# EAGLE design lipo_charger_sense_nicolai (EAGLE 7.1.0)
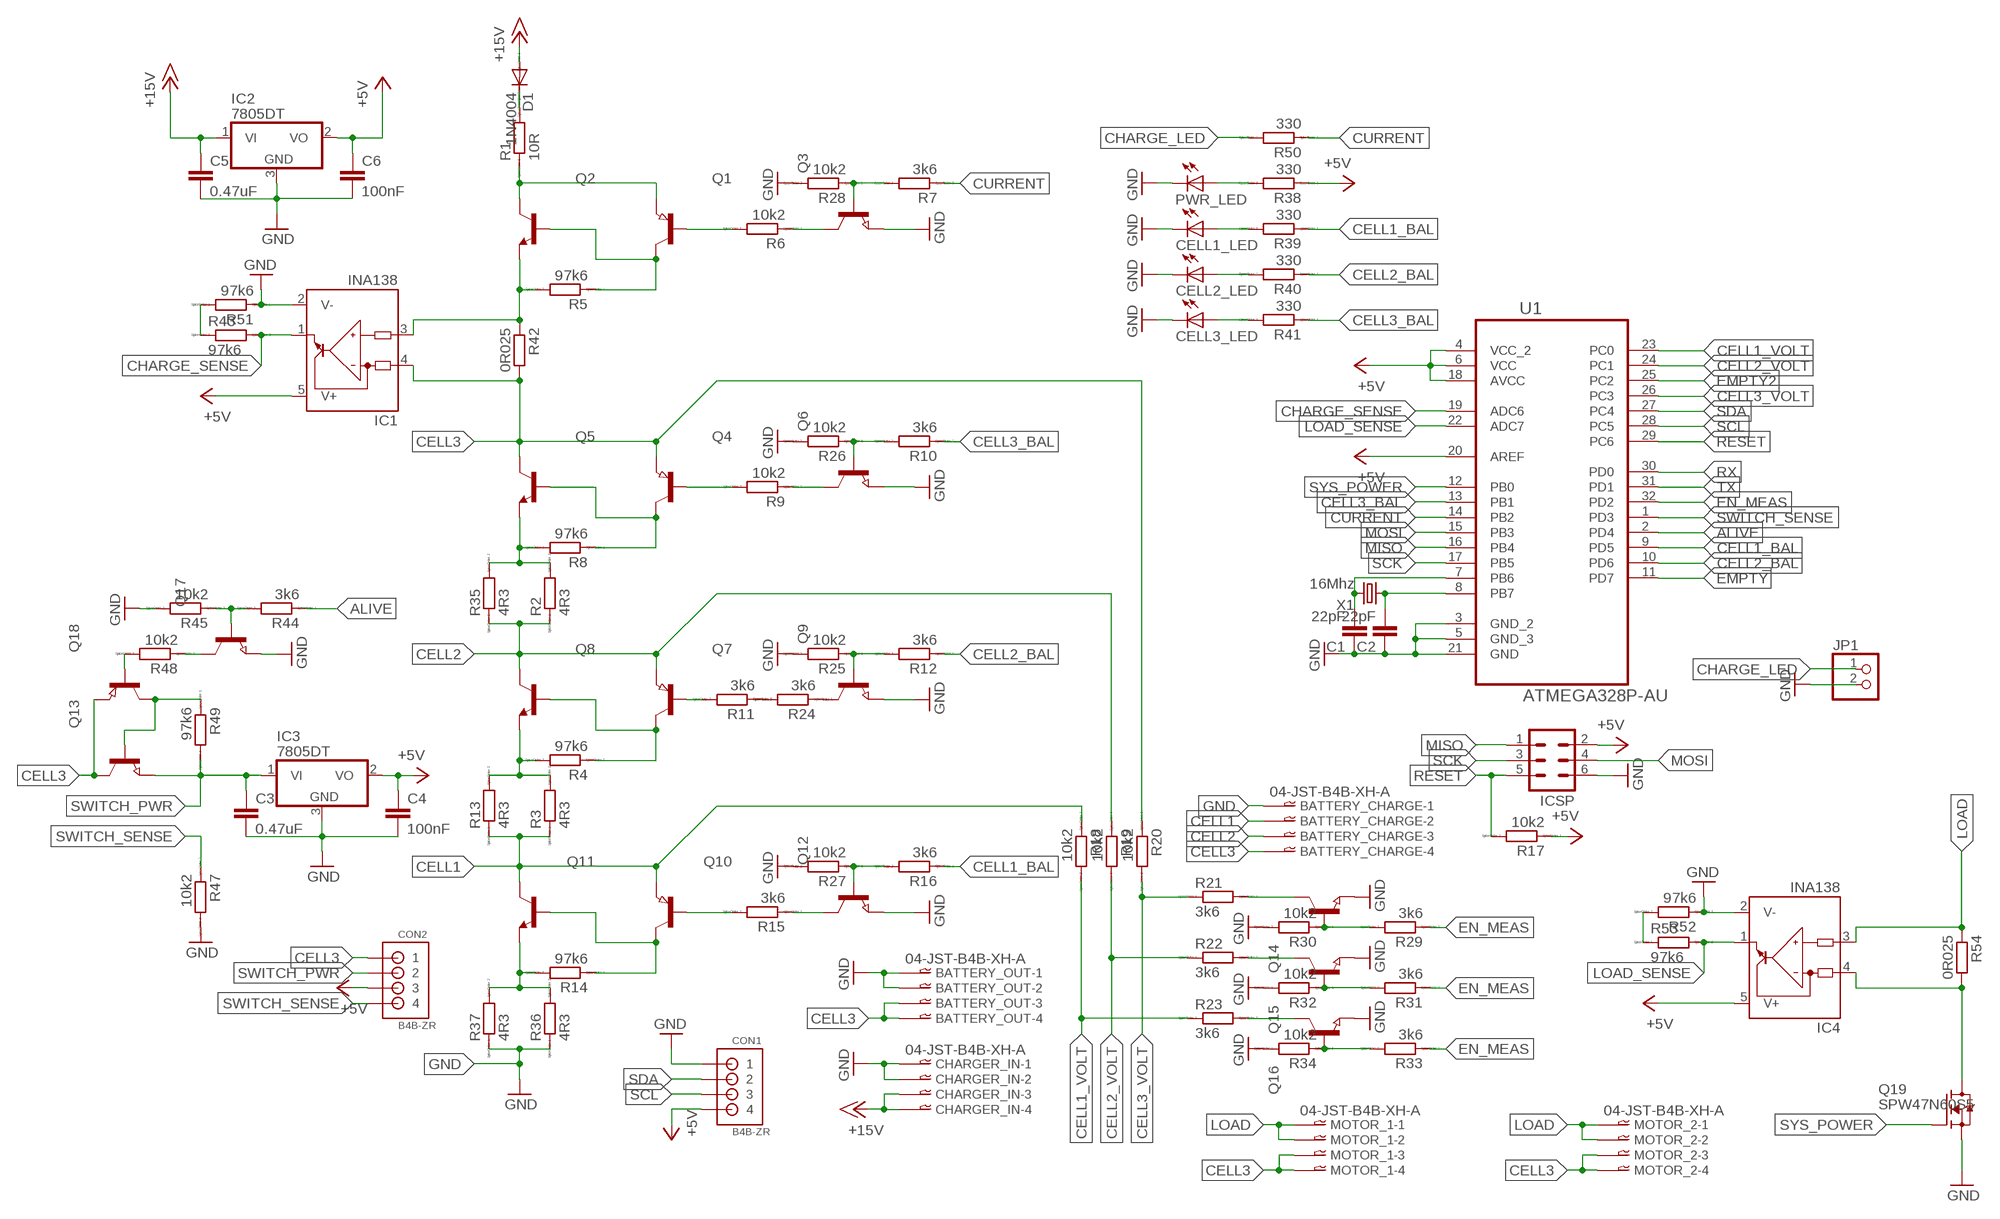
[diagram p0: schematic, sheet 1]

## Parts
BATTERY_CHARGE  04-JST-B4B-XH-A  [B4B-XH]
BATTERY_OUT  04-JST-B4B-XH-A  [B4B-XH]
C1  22pF  C-EUC0805K  [C0805K]
C2  22pF  C-EUC0805K  [C0805K]
C3  0.47uF  C-EUC0805K  [C0805K]
C4  100nF  C-EUC0805K  [C0805K]
C5  0.47uF  C-EUC0805K  [C0805K]
C6  100nF  C-EUC0805K  [C0805K]
CELL1_LED  LEDSMT1206  [1206]
CELL2_LED  LEDSMT1206  [1206]
CELL3_LED  LEDSMT1206  [1206]
CHARGER_IN  04-JST-B4B-XH-A  [B4B-XH]
CON1  B4B-ZR  [B4B-ZR]
CON2  B4B-ZR  [B4B-ZR]
D1  1N4004  [DO41-10]
IC1  INA138  [SOT23-5]
IC2  7805DT  [TO252]
IC3  7805DT  [TO252]
IC4  INA138  [SOT23-5]
ICSP  MA03-2  [MA03-2]
JP1  PINHD-1X2/90  [1X02/90]
MOTOR_1  04-JST-B4B-XH-A  [B4B-XH]
MOTOR_2  04-JST-B4B-XH-A  [B4B-XH]
PWR_LED  LEDSMT1206  [1206]
Q1  PNP-TRANSISTOR_SOT23  [SOT23]
Q2  -NPN-  [DPAK]
Q3  NPN-TRANSISTOR_SOT23  [SOT23]
Q4  PNP-TRANSISTOR_SOT23  [SOT23]
Q5  -NPN-  [DPAK]
Q6  NPN-TRANSISTOR_SOT23  [SOT23]
Q7  PNP-TRANSISTOR_SOT23  [SOT23]
Q8  -NPN-  [DPAK]
Q9  NPN-TRANSISTOR_SOT23  [SOT23]
Q10  PNP-TRANSISTOR_SOT23  [SOT23]
Q11  -NPN-  [DPAK]
Q12  NPN-TRANSISTOR_SOT23  [SOT23]
Q13  NPN-TRANSISTOR_SOT23  [SOT23]
Q14  NPN-TRANSISTOR_SOT23  [SOT23]
Q15  NPN-TRANSISTOR_SOT23  [SOT23]
Q16  NPN-TRANSISTOR_SOT23  [SOT23]
Q17  NPN-TRANSISTOR_SOT23  [SOT23]
Q18  PNP-TRANSISTOR_SOT23  [SOT23]
Q19  SPW47N60S5  [DPACK_2]
R1  10R  R-EU_SMW5  [SMW5]
R2  4R3  R-EU_SMW5  [SMW5]
R3  4R3  R-EU_SMW5  [SMW5]
R4  97k6  R-EU_R0805  [R0805]
R5  97k6  R-EU_R0805  [R0805]
R6  10k2  R-EU_R0805  [R0805]
R7  3k6  R-EU_R0805  [R0805]
R8  97k6  R-EU_R0805  [R0805]
R9  10k2  R-EU_R0805  [R0805]
R10  3k6  R-EU_R0805  [R0805]
R11  3k6  R-EU_R0805  [R0805]
R12  3k6  R-EU_R0805  [R0805]
R13  4R3  R-EU_SMW5  [SMW5]
R14  97k6  R-EU_R0805  [R0805]
R15  3k6  R-EU_R0805  [R0805]
R16  3k6  R-EU_R0805  [R0805]
R17  10k2  R-EU_R0805  [R0805]
R18  10k2  R-EU_R0805  [R0805]
R19  10k2  R-EU_R0805  [R0805]
R20  10k2  R-EU_R0805  [R0805]
R21  3k6  R-EU_R0805  [R0805]
R22  3k6  R-EU_R0805  [R0805]
R23  3k6  R-EU_R0805  [R0805]
R24  3k6  R-EU_R0805  [R0805]
R25  10k2  R-EU_R0805  [R0805]
R26  10k2  R-EU_R0805  [R0805]
R27  10k2  R-EU_R0805  [R0805]
R28  10k2  R-EU_R0805  [R0805]
R29  3k6  R-EU_R0805  [R0805]
R30  10k2  R-EU_R0805  [R0805]
R31  3k6  R-EU_R0805  [R0805]
R32  10k2  R-EU_R0805  [R0805]
R33  3k6  R-EU_R0805  [R0805]
R34  10k2  R-EU_R0805  [R0805]
R35  4R3  R-EU_SMW5  [SMW5]
R36  4R3  R-EU_SMW5  [SMW5]
R37  4R3  R-EU_SMW5  [SMW5]
R38  330  R-EU_R0805  [R0805]
R39  330  R-EU_R0805  [R0805]
R40  330  R-EU_R0805  [R0805]
R41  330  R-EU_R0805  [R0805]
R42  0R025  R-EU_R2512  [R2512]
R43  97k6  R-EU_R0805  [R0805]
R44  3k6  R-EU_R0805  [R0805]
R45  10k2  R-EU_R0805  [R0805]
R47  10k2  R-EU_R0805  [R0805]
R48  10k2  R-EU_R0805  [R0805]
R49  97k6  R-EU_R0805  [R0805]
R50  330  R-EU_R0805  [R0805]
R51  97k6  R-EU_R0805  [R0805]
R52  97k6  R-EU_R0805  [R0805]
R53  97k6  R-EU_R0805  [R0805]
R54  0R025  R-EU_R2512  [R2512]
U1  ATMEGA328P-AU  [QFP80P900X900X120-32N]
X1  16Mhz  CRYSTALS-NOGND-12SMX-A  [7.5X5-2-PAD]

## Nets
+5V: C4.1 C6.1 CON1.4 CON2.3 IC1.5(V+) IC2.2(VO) IC3.2(VO) IC4.5(V+) ICSP.2 R17.1 R38.1 U1.4(VCC_2) U1.6(VCC) U1.18(AVCC) U1.20(AREF)
+15V: C5.1 CHARGER_IN.P$3 CHARGER_IN.P$4 D1.A IC2.1(VI)
ALIVE: R44.1 U1.2(PD4)
CELL1: BATTERY_CHARGE.P$2 Q10.2(E) Q11.3(C) R3.P$1 R13.P$1 R18.1
CELL1_BAL: R16.1 R39.1 U1.9(PD5)
CELL1_VOLT: R18.2 R23.1 U1.23(PC0)
CELL2: BATTERY_CHARGE.P$3 Q7.2(E) Q8.3(C) R2.P$1 R19.1 R35.P$1
CELL2_BAL: R12.1 R40.1 U1.10(PD6)
CELL2_VOLT: R19.2 R22.1 U1.24(PC1)
CELL3: BATTERY_CHARGE.P$4 BATTERY_OUT.P$3 BATTERY_OUT.P$4 CON2.1 IC1.4(IN-) MOTOR_1.P$3 MOTOR_1.P$4 MOTOR_2.P$3 MOTOR_2.P$4 Q4.2(E) Q5.3(C) Q13.3(C) Q18.2(E) R20.1 R42.2
CELL3_BAL: R10.1 R41.1 U1.13(PB1)
CELL3_VOLT: R20.2 R21.1 U1.26(PC3)
CELL5: IC4.4(IN-) Q19.D R54.2
CHARGE_LED: JP1.1 R50.2
CHARGE_SENSE: IC1.1(OUT) R43.2 U1.19(ADC6)
CURRENT: R7.1 R50.1 U1.14(PB2)
EMPTY: U1.11(PD7)
EMPTY2: U1.25(PC2)
EN_MEAS: R29.1 R31.1 R33.1 U1.32(PD2)
GND: BATTERY_CHARGE.P$1 BATTERY_OUT.P$1 BATTERY_OUT.P$2 C1.1 C2.1 C3.2 C4.2 C5.2 C6.2 CELL1_LED.C CELL2_LED.C CELL3_LED.C CHARGER_IN.P$1 CHARGER_IN.P$2 CON1.1 IC1.2(V-) IC2.3(GND) IC3.3(GND) IC4.2(V-) ICSP.6 JP1.2 PWR_LED.C Q3.2(E) Q6.2(E) Q9.2(E) Q12.2(E) Q14.2(E) Q15.2(E) Q16.2(E) Q17.2(E) Q19.S R25.2 R26.2 R27.2 R28.2 R30.2 R32.2 R34.2 R36.P$1 R37.P$1 R45.2 R47.2 R51.1 R52.1 U1.3(GND_2) U1.5(GND_3) U1.21(GND)
LOAD: IC4.3(IN+) MOTOR_1.P$1 MOTOR_1.P$2 MOTOR_2.P$1 MOTOR_2.P$2 R54.1
LOAD_SENSE: IC4.1(OUT) R53.2 U1.22(ADC7)
MISO: ICSP.1 U1.16(PB4)
MOSI: ICSP.4 U1.15(PB3)
N$1: Q1.1(B) R6.2
N$2: Q1.3(C) Q2.1(B) R5.1
N$3: Q1.2(E) Q2.3(C) R1.P$1
N$4: Q7.1(B) R11.2
N$5: Q7.3(C) Q8.1(B) R4.1
N$6: Q3.3(C) R6.1
N$7: Q3.1(B) R7.2 R28.1
N$8: Q4.1(B) R9.2
N$9: Q4.3(C) Q5.1(B) R8.1
N$10: C2.2 U1.8(PB7) X1.1
N$11: Q5.4(E) R2.P$2 R8.2 R35.P$2
N$12: Q6.3(C) R9.1
N$13: Q6.1(B) R10.2 R26.1
N$14: R11.1 R24.2
N$15: Q8.4(E) R3.P$2 R4.2 R13.P$2
N$16: Q9.3(C) R24.1
N$17: Q9.1(B) R12.2 R25.1
N$18: Q10.1(B) R15.2
N$19: Q10.3(C) Q11.1(B) R14.1
N$20: Q16.3(C) R23.2
N$21: Q11.4(E) R14.2 R36.P$2 R37.P$2
N$22: Q12.3(C) R15.1
N$23: Q12.1(B) R16.2 R27.1
N$24: Q15.3(C) R22.2
N$25: Q14.3(C) R21.2
N$26: PWR_LED.A R38.2
N$27: Q14.1(B) R29.2 R30.1
N$28: CELL1_LED.A R39.2
N$29: Q15.1(B) R31.2 R32.1
N$30: CELL2_LED.A R40.2
N$31: CELL3_LED.A R41.2
N$32: Q16.1(B) R33.2 R34.1
N$33: IC1.3(IN+) Q2.4(E) R5.2 R42.1
N$36: D1.C R1.P$2
N$37: Q17.1(B) R44.2 R45.1
N$39: Q13.1(B) Q18.3(C) R49.1
N$40: R43.1 R51.2
N$41: Q18.1(B) R48.2
N$42: Q17.3(C) R48.1
N$44: R52.2 R53.1
PB6: C1.2 U1.7(PB6) X1.2
RESET: ICSP.5 R17.2 U1.29(PC6)
RX: U1.30(PD0)
SCK: ICSP.3 U1.17(PB5)
SCL: CON1.3 U1.28(PC5)
SDA: CON1.2 U1.27(PC4)
SWITCH_PWR: C3.1 CON2.2 IC3.1(VI) Q13.2(E) R49.2
SWITCH_SENSE: CON2.4 R47.1 U1.1(PD3)
SYS_POWER: Q19.G U1.12(PB0)
TX: U1.31(PD1)

## Library data of the parts
BATTERY_CHARGE BATTERY_OUT CHARGER_IN MOTOR_1 MOTOR_2 = bt_con-jst-xh:04-JST: JST CONNECTOR
C1-C6 = rcl:C-EU: CAPACITOR, European symbol
CELL1_LED CELL2_LED CELL3_LED PWR_LED = led:LED: LED OSRAM: - CHIPLED LG R971, LG N971, LY N971, LG Q971, LY Q971, LO R971, LY R971 LH N974, LH R974 LS Q976, LO Q976, LY Q976 LO Q996 - Hyper CHIPLED LW Q18S LB Q993, LB Q99A, LB R99A - SideLED LS A670, LO A670, LY A670, LG A670, LP A670 LB A673, LV A673, LT A673, LW A673 LH A674 LY A675 LS A676, LA A676, LO A676, LY A676, LW A676 LS A679, LY A679, LG A679 - Hyper Micro SIDELED® LS Y876, LA Y876, LO Y876, LY Y876 LT Y87S - SmartLED LW L88C, LW L88S LB L89C, LB L89S, LG L890 LS L89K, LO L89K, LY L89K LS L896, LA L896, LO L896, LY L896 - TOPLED LS T670, LO T670, LY T670, LG T670, LP T670 LSG T670, LSP T670, LSY T670, LOP T670, LYG T670 LG T671, LOG T671, LSG T671 LB T673, LV T673, LT T673, LW T673 LH T674 LS T676, LA T676, LO T676, LY T676, LB T676, LH T676, LSB T676, LW T676 LB T67C, LV T67C, LT T67C, LS T67K, LO T67K, LY T67K, LW E67C LS E67B, LA E67B, LO E67B, LY E67B, LB E67C, LV E67C, LT E67C LW T67C LS T679, LY T679, LG T679 LS T770, LO T770, LY T770, LG T770, LP T770 LB T773, LV T773, LT T773, LW T773 LH T774 LS E675, LA E675, LY E675, LS T675 LS T776, LA T776, LO T776, LY T776, LB T776 LHGB T686 LT T68C, LB T68C - Hyper Mini TOPLED® LB M676 - Mini TOPLED Santana® LG M470 LS M47K, LO M47K, LY M47K Source: http://www.osram.convergy.de LUXEON: - LUMILED® LXK2-PW12-R00, LXK2-PW12-S00, LXK2-PW14-U00, LXK2-PW14-V00 LXK2-PM12-R00, LXK2-PM12-S00, LXK2-PM14-U00 LXK2-PE12-Q00, LXK2-PE12-R00, LXK2-PE12-S00, LXK2-PE14-T00, LXK2-PE14-U00 LXK2-PB12-K00, LXK2-PB12-L00, LXK2-PB12-M00, LXK2-PB14-N00, LXK2-PB14-P00, LXK2-PB14-Q00 LXK2-PR12-L00, LXK2-PR12-M00, LXK2-PR14-Q00, LXK2-PR14-R00 LXK2-PD12-Q00, LXK2-PD12-R00, LXK2-PD12-S00 LXK2-PH12-R00, LXK2-PH12-S00 LXK2-PL12-P00, LXK2-PL12-Q00, LXK2-PL12-R00 Source: www.luxeon.com KINGBRIGHT: KA-3528ASYC Source: www.kingbright.com
CON1 CON2 = jst:B4B-ZR: JST-ZH Connector 4 pol, 1.5mm pitch Package: B4B-ZR Source: http://www.jst-mfg.com/product/pdf/eng/eZH.pdf
D1 = diode:1N4004: DIODE general purpose rectifier, 1 A
IC1 IC4 = burr-brown:INA138: High-Side Measurement Current Shunt Monitor; MF: TEXAS INSTRUMENTS; MPN: INA138NA/250; OC_FARNELL: 1564888; OC_NEWARK: 80K5906
IC2 IC3 = linear:78*: Positive VOLTAGE REGULATOR Source: http://cache.national.com/ds/LM/LM78L05.pdf http://www.fairchildsemi.com/ds/LM/LM7805.pdf
ICSP = con-lstb:MA03-2: PIN HEADER; OC_FARNELL: unknown; OC_NEWARK: unknown
JP1 = pinhead:PINHD-1X2: PIN HEADER
Q1 Q4 Q7 Q10 Q18 = semicon-smd-ipc:PNP-TRANSISTOR_: PNP TRANSISTOR
Q2 Q5 Q8 Q11 = NPN_transistor:*-NPN-: NPN Transistror BF959 corrected 2008.03.06
Q3 Q6 Q9 Q12-Q17 = semicon-smd-ipc:NPN-TRANSISTOR_: NPN TRANSISTOR
Q19 = IRFS4310PBF:SPW47N60S5: Cool MOS Power Transistor
R1-R3 R13 R35-R37 = robocup:R-EU_: RESISTOR, European symbol
R4-R12 R14-R34 R38-R41 R43-R45 R47-R53 = resistor:R-EU_: RESISTOR, European symbol; SPICEPREFIX: R
R42 R54 = rcl:R-EU_: RESISTOR, European symbol
U1 = Atmel_By_element14_Batch_1-00:ATMEGA328P-AU: 8-bit Microcontroller with In-System Programmable Flash; MPN: ATMEGA328P-AU; OC_FARNELL: 1715486; OC_NEWARK: 14R4631; PACKAGE: TQFP-32; SUPPLIER: Atmel
X1 = IQD-Frequency-Products:CRYSTALS-NOGND: CRYSTALS CAN NOT GROUNDED

## Board
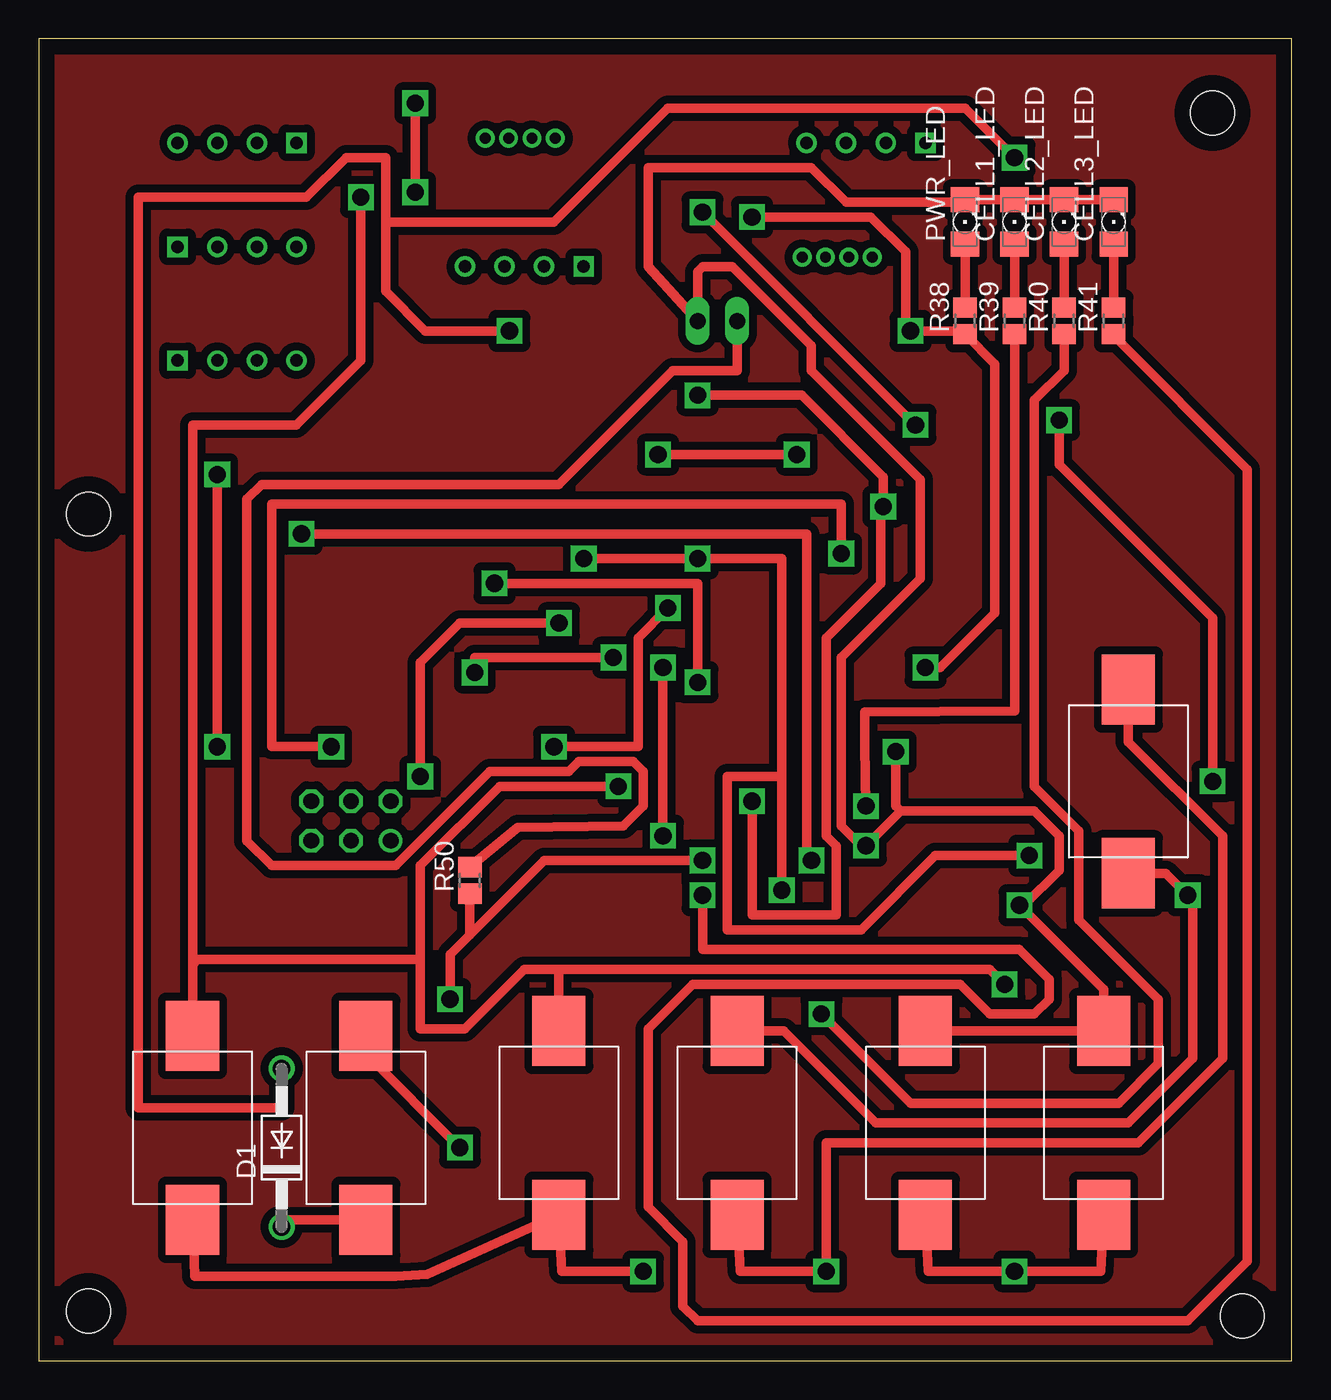
[diagram p1: board, top side]
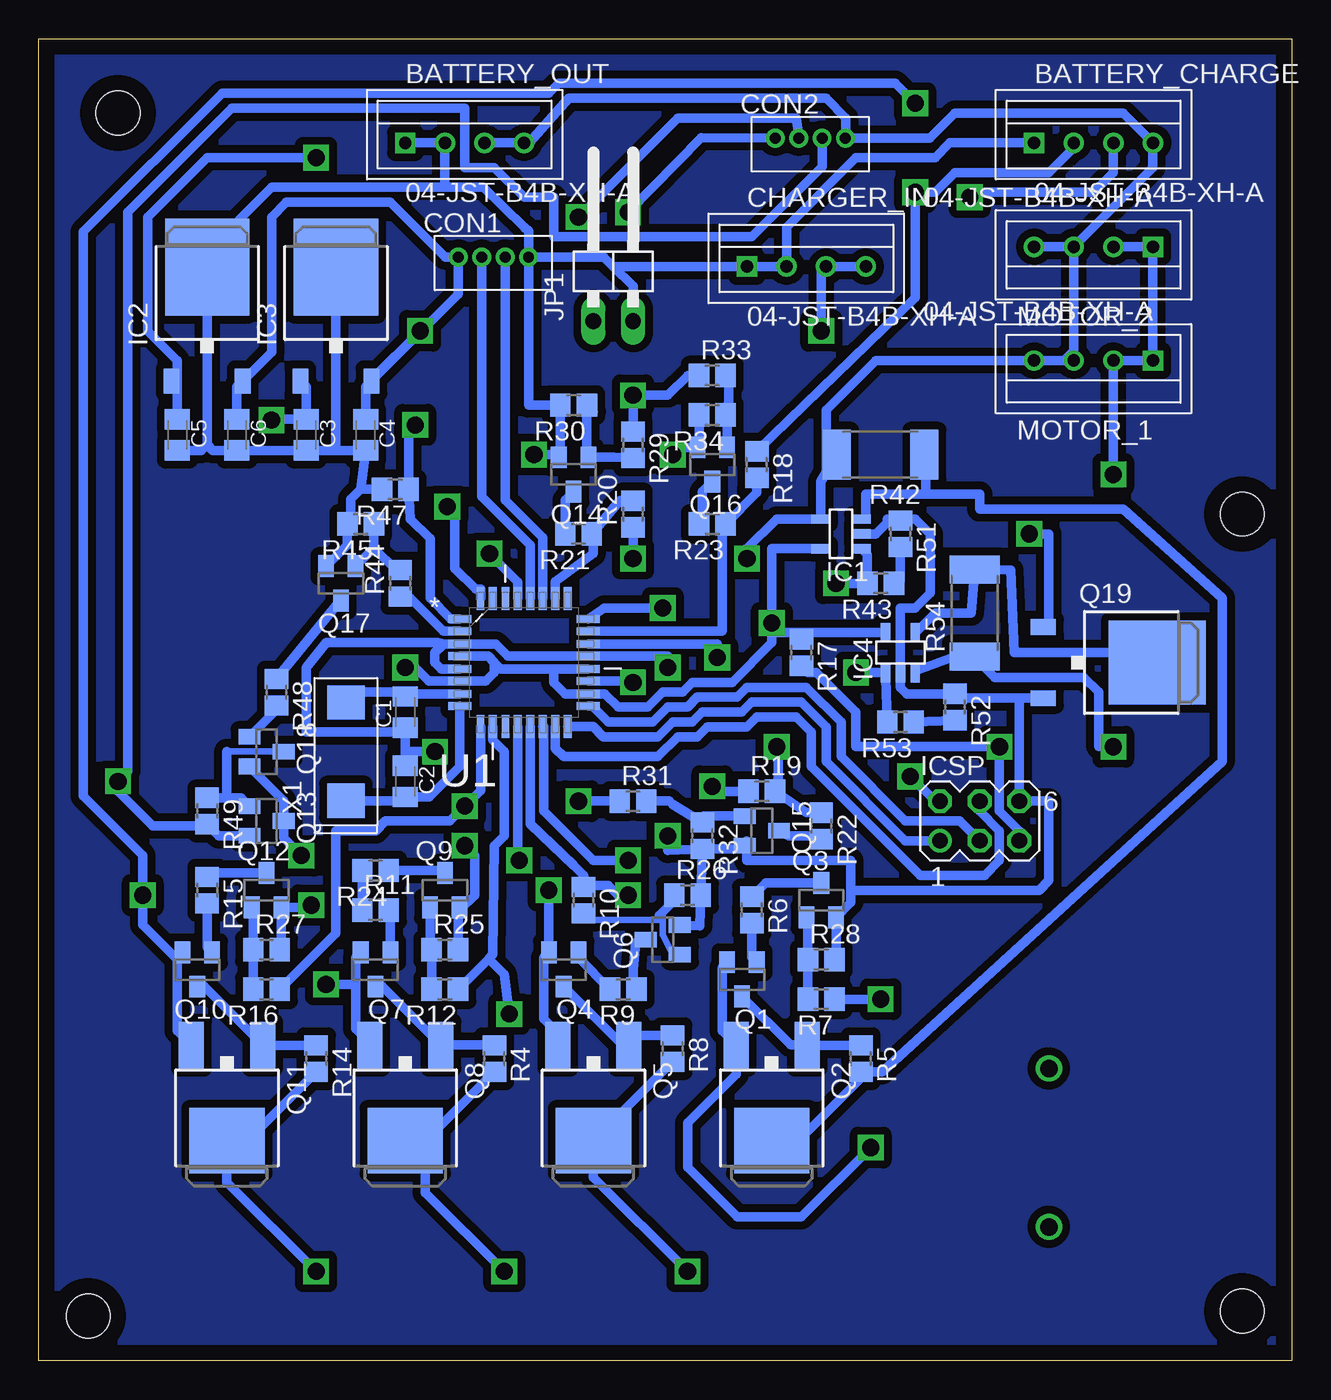
[diagram p2: board, bottom side, seen from below]

Size 80.31 x 84.76 mm. Coordinates in mm from the lower left corner, seen from the top.
Outline: 0,0 80.31,0 80.31,84.76 0,84.76 0,0
Copper layers (1*16): Top 0.035mm / dielectric 1.5mm / Bottom 0.035mm
Design rules "default *": minimum track width 10mil, minimum drill 24mil, track to track 20mil, track to pad 20mil, pad to pad 8mil, via to via 8mil, smd to smd 20mil, copper to edge 40mil, drill to drill 8mil, minimum pad ring 10mil, minimum via ring 8mil, stop-mask expansion 4mil, vias tented up to drill 0mil, thermal gap 10mil
Holes 2.8 mm at 75.25,80.01 3.17,54.29 3.17,3.17 77.15,2.86

### Footprints (pad centres in the part's own frame; a part is rotated, then mirrored left to right if it is on the bottom)
B4B-XH = drill 0.8 square: P$1 -3.81,0 | drill 0.8: P$2 -1.27,0; P$3 1.27,0; P$4 3.81,0
C0805K = smd 1.3 x 1.6: 1 -1,0; 2 1,0
1206 = smd 1.6 x 1.803: A -1.422,0; C 1.422,0
B4B-ZR = drill 0.7: 1 6,-1.3; 2 4.5,-1.3; 3 3,-1.3; 4 1.5,-1.3
DO41-10 = drill 1.118: A 5.08,0; C -5.08,0
SOT23-5 = smd 0.6 x 1.2: 1 -0.95,-1.306; 2 0,-1.306; 3 0.95,-1.306; 4 0.95,1.306; 5 -0.95,1.306
TO252 = smd 1 x 1.6: 1 -2.28,-4.8; 2 2.28,-4.8 | smd 5.4 x 6.2: 3 0,2.5
MA03-2 = drill 1.016: 1 -2.54,-1.27 | drill 1.016 octagon: 2 -2.54,1.27; 3 0,-1.27; 4 0,1.27; 5 2.54,-1.27; 6 2.54,1.27
1X02/90 = drill 1.016 long: 1 -1.27,-3.81; 2 1.27,-3.81
SOT23 = smd 1 x 1.4: 1 -0.95,-1.1; 2 0.95,-1.1; 3 0,1.1
DPAK = smd 1.6 x 3: 1 -2.28,-4.04; 3 2.28,-4.04 | smd 4.826 x 4.191: 4 0,2.096
DPACK_2 = smd 5.4 x 6.2: D 0,2.5 | smd 1 x 1.6: G -2.28,-4.8; S 2.28,-4.8
SMW5 = smd 4.5 x 3.4: P$1 -7.8,0; P$2 3.99,0
R0805 = smd 1.3 x 1.5: 1 -0.85,0; 2 0.85,0
R2512 = smd 1.8 x 3.2: 1 -2.8,0; 2 2.8,0
QFP80P900X900X120-32N = smd 1.473 x 0.508: 1 -4.115,2.794; 2 -4.115,2.007; 3 -4.115,1.194; 4 -4.115,0.406; 5 -4.115,-0.406; 6 -4.115,-1.194; 7 -4.115,-2.007; 8 -4.115,-2.794; 17 4.115,-2.794; 18 4.115,-2.007; 19 4.115,-1.194; 20 4.115,-0.406; 21 4.115,0.406; 22 4.115,1.194; 23 4.115,2.007; 24 4.115,2.794 | smd 0.508 x 1.473: 9 -2.794,-4.115; 10 -2.007,-4.115; 11 -1.194,-4.115; 12 -0.406,-4.115; 13 0.406,-4.115; 14 1.194,-4.115; 15 2.007,-4.115; 16 2.794,-4.115; 25 2.794,4.115; 26 2.007,4.115; 27 1.194,4.115; 28 0.406,4.115; 29 -0.406,4.115; 30 -1.194,4.115; 31 -2.007,4.115; 32 -2.794,4.115
7.5X5-2-PAD = smd 2.2 x 2.4: 1 -3.15,0; 2 3.15,0

### Placement (x,y rotation side)
BATTERY_CHARGE  12.7,78.11 0 bottom
BATTERY_OUT  53.02,78.11 0 bottom
C1  56.83,41.59 90 bottom
C2  56.83,37.15 270 bottom
C3  63.18,59.37 270 bottom
C4  59.37,59.37 270 bottom
C5  71.44,59.37 270 bottom
C6  67.63,59.37 270 bottom
CELL1_LED  62.55,73.03 90 top
CELL2_LED  65.72,73.03 90 top
CELL3_LED  68.9,73.03 90 top
CHARGER_IN  31.11,70.17 0 bottom
CON1  54.93,72.07 0 bottom
CON2  34.61,79.69 0 bottom
D1  15.56,13.65 90 top
IC1  28.89,53.02 90 bottom
IC2  69.53,67.63 0 bottom
IC3  61.28,67.63 0 bottom
IC4  25.08,45.4 0 bottom
ICSP  20,34.61 0 bottom
JP1  43.5,70.48 0 bottom
MOTOR_1  12.7,64.14 180 bottom
MOTOR_2  12.7,71.44 180 bottom
PWR_LED  59.37,73.03 90 top
Q1  35.24,24.45 180 bottom
Q2  33.34,16.19 180 bottom
Q3  30.16,29.53 0 bottom
Q4  46.67,25.08 180 bottom
Q5  44.77,16.19 180 bottom
Q6  40.32,26.99 90 bottom
Q7  58.74,25.08 180 bottom
Q8  56.83,16.19 180 bottom
Q9  54.29,30.16 0 bottom
Q10  70.17,25.08 180 bottom
Q11  68.26,16.19 180 bottom
Q12  65.72,30.16 0 bottom
Q13  65.72,34.61 270 bottom
Q14  46.04,56.83 180 bottom
Q15  33.97,33.97 270 bottom
Q16  37.15,57.47 180 bottom
Q17  60.96,49.85 180 bottom
Q18  65.72,39.05 270 bottom
Q19  11.11,44.77 270 bottom
R1  20.95,13.02 270 top
R2  33.34,13.34 270 top
R3  69.85,39.05 90 top
R4  51.12,19.37 270 bottom
R5  27.62,19.37 270 bottom
R6  34.61,28.89 270 bottom
R7  30.16,23.18 180 bottom
R8  39.69,20 270 bottom
R9  42.86,23.81 180 bottom
R10  45.4,29.53 270 bottom
R11  58.74,28.89 0 bottom
R12  54.29,23.81 180 bottom
R13  44.77,13.34 270 top
R14  62.55,19.37 270 bottom
R15  69.53,30.16 270 bottom
R16  65.72,23.81 180 bottom
R17  31.43,45.4 270 bottom
R18  34.29,57.47 270 bottom
R19  33.97,36.51 0 bottom
R20  42.23,54.29 90 bottom
R21  45.72,53.02 180 bottom
R22  30.16,34.29 270 bottom
R23  37.15,53.66 180 bottom
R24  58.74,31.43 180 bottom
R25  54.29,26.35 0 bottom
R26  38.73,29.84 0 bottom
R27  65.72,26.35 0 bottom
R28  30.16,25.72 0 bottom
R29  42.23,58.74 270 bottom
R30  46.04,61.28 180 bottom
R31  42.23,35.88 0 bottom
R32  37.78,33.66 270 bottom
R33  37.15,63.18 0 bottom
R34  37.15,60.64 180 bottom
R35  9.84,13.02 270 top
R36  68.26,13.34 270 top
R37  56.83,13.34 270 top
R38  59.37,66.67 90 top
R39  62.55,66.67 90 top
R40  65.72,66.67 90 top
R41  68.9,66.67 90 top
R42  26.35,58.1 180 bottom
R43  26.35,49.85 180 bottom
R44  57.15,49.85 90 bottom
R45  59.69,53.66 180 bottom
R47  57.47,55.88 180 bottom
R48  65.09,42.86 270 bottom
R49  69.53,35.24 270 bottom
R50  27.62,30.8 90 top
R51  25.08,53.02 270 bottom
R52  21.59,41.91 270 bottom
R53  25.08,40.96 180 bottom
R54  20.32,47.94 90 bottom
U1  49.21,44.77 0 bottom
X1  60.64,39.05 90 bottom

### Tracks (layer width: path | path; a pad name or v marks a point on that pad's centre or on a via)
+5V  (via drill 1.1)
  Top 0.61: v24.45,37.47 24.45,44.77 26.99,47.31 v33.34,47.31 | v45.72,73.34 53.34,73.34 55.56,71.12 55.56,66.36 v55.88,66.04 59.16,66.04 R38.1 61.28,63.92 61.28,47.94 57.78,44.45 v56.83,44.45
  Bottom 0.61: C6.1 67.63,62.45 IC2.2 65.41,64.67 65.41,73.34 64.45,74.3 57.78,74.3 54.26,70.77 CON1.4 53.43,68.4 IC3.2 | C4.1 59.37,62.45 IC3.2 | U1.4 51.52,45.17 51.12,44.77 | 51.12,44.77 51.12,44.13 51.68,43.57 U1.6 55.32,43.57 56.2,44.45 v56.83,44.45 | U1.20 47.31,44.36 | 47.31,44.36 50.71,44.36 51.12,44.77 | 47.31,44.36 47.31,43.5 46.57,42.76 U1.18 44.03,42.76 43.18,41.91 41.27,41.91 40.32,42.86 39.05,42.86 38.42,43.5 35.88,43.5 33.34,46.04 33.34,46.67 | IC1.5 33.34,52.07 v33.34,47.31 33.34,46.67 | IC4.5 31.43,46.71 | 31.43,46.71 33.3,46.71 33.34,46.67 | R17.1 31.43,46.71 | ICSP.2 22.86,35.88 v24.45,37.47 | IC3.2 59,62.92 v55.88,66.04 | CON2.3 31.61,78.6 31.75,79.69 39.37,79.69 v45.72,73.34
+15V  (via drill 1.1)
  Top 0.61: 22.23,73.03 22.23,77.15 19.68,77.15 17.14,74.61 6.35,74.61 6.35,16.19 15.56,16.19 D1.A | 22.23,73.03 22.23,68.58 24.77,66.04 v30.16,66.04 | v62.55,77.15 59.37,80.33 40.32,80.33 33.02,73.03 22.23,73.03
  Bottom 0.61: C5.1 71.44,62.45 | 71.44,62.45 IC2.1 | CHARGER_IN.P$4 CHARGER_IN.P$3 30.16,69.85 v30.16,66.04 | 71.44,62.45 71.44,64.14 73.34,66.04 73.34,73.34 69.53,77.15 v62.55,77.15
ALIVE
  Bottom 0.61: U1.2 54.39,46.77 56.52,48.9 56.83,48.68 R44.1
CELL1  (via drill 1.1)
  Top 0.61: R3.P$1 72.25,31.25 v73.66,29.84 73.98,29.53 73.98,19.37 69.85,15.24 53.66,15.24 47.76,21.14 R13.P$1 | v24.13,74.93 v24.13,80.64
  Bottom 0.61: Q10.2 71.12,26.04 71.44,25.72 | 71.44,25.72 71.44,21.13 Q11.3 | 71.44,25.72 73.66,27.94 v73.66,29.84 73.66,32.38 77.47,36.2 77.47,72.39 68.58,81.28 47.62,81.28 46.99,81.92 25.4,81.92 v24.13,80.64 | BATTERY_CHARGE.P$2 13.97,77.79 15.56,76.2 21.59,76.2 22.86,74.93 v24.13,74.93 24.13,68.16 R18.1
CELL1_BAL  (via drill 1.1)
  Top 0.61: R39.1 62.55,41.66 52.96,41.59 52.96,39.43 v53.02,35.56
  Bottom 0.61: U1.9 52.01,36.58 v53.02,35.56 53.98,34.61 58.1,34.61 58.74,33.97 61.28,33.97 61.28,27.41 R16.1
CELL1_VOLT
  Bottom 0.61: U1.23 36.51,46.77 36.51,53.66 R23.1 34.29,55.66 R18.2
CELL2  (via drill 1.1)
  Top 0.61: v37.15,36.83 29.53,36.83 24.45,31.75 24.45,25.72 | 24.45,25.72 24.45,21.27 27.3,21.27 31.11,25.08 33.34,25.08 | 33.34,25.08 60.96,25.08 v61.91,24.13 | R2.P$1 33.34,25.08 | R35.P$1 9.84,25.4 | 9.84,25.4 10.16,25.72 24.45,25.72 | v20.64,74.61 20.64,64.14 16.51,60.01 9.84,60.01 9.84,25.4
  Bottom 0.61: Q7.2 60.01,25.86 60.01,24.13 | 60.01,24.13 60.01,21.27 59.11,20.38 Q8.3 | R19.1 36.83,36.51 v37.15,36.83 | v61.91,24.13 60.01,24.13 | BATTERY_CHARGE.P$3 11.43,76.2 12.7,74.93 20.32,74.93 v20.64,74.61
CELL2_BAL  (via drill 1.1)
  Top 0.61: R40.1 65.72,63.5 63.82,61.59 63.82,36.83 66.67,33.97 66.67,28.26 71.75,23.18 71.75,19.05 69.22,16.51 55.88,16.51 v50.16,22.23
  Bottom 0.61: U1.10 51.22,39.79 50.48,39.05 50.48,33.66 51.12,33.02 51.22,26.04 51.49,25.77 | 51.49,25.77 R12.1 | v50.16,22.23 50.48,24.77 51.49,25.77
CELL2_VOLT  (via drill 1.1)
  Top 0.61: v40.32,48.26 38.42,46.35 38.42,39.37 v33.02,39.37
  Bottom 0.61: U1.24 44.08,48.26 v40.32,48.26 | v33.02,39.37 32.92,39.27 32.92,37.35 R19.2 31.11,35.14 R22.1
CELL3  (via drill 1.1)
  Top 0.61: 47.62,37.47 47.62,51.44 v42.23,51.44 v34.92,51.44 | 47.62,37.47 v47.62,30.16 | v63.5,32.38 57.47,32.38 52.7,27.62 44.13,27.62 44.13,37.47 47.62,37.47
  Bottom 0.61: Q5.3 47.05,21.01 47.94,21.91 47.94,25.86 Q4.2 47.62,28.89 v47.62,30.16 | 66.99,37.93 Q18.2 64.62,35.9 Q13.3 64.62,33.51 v63.5,32.38 | R20.1 v42.23,51.44 | v34.92,51.44 34.92,52.07 33.02,53.97 IC1.4 30.2,56.38 R42.2 29.84,56.94 29.84,60.96 26.67,64.14 MOTOR_1.P$4 14.61,64.14 | MOTOR_2.P$4 MOTOR_2.P$3 | MOTOR_1.P$3 14.61,64.14 | BATTERY_OUT.P$3 BATTERY_OUT.P$4 48.9,78.11 46.35,80.96 29.84,80.96 28.57,79.69 28.57,78.42 CON2.1 23.21,78.39 21.59,80.01 10.79,80.01 BATTERY_CHARGE.P$4 8.89,76.52 MOTOR_2.P$3 | MOTOR_2.P$3 13.97,64.77 14.61,64.14
CELL3_BAL  (via drill 1.1)
  Top 0.61: v42.55,29.84 42.55,26.35 62.87,26.35 64.77,24.45 64.77,23.18 63.82,22.23 60.96,22.23 59.05,24.13 41.91,24.13 39.05,21.27 39.05,9.84 41.27,7.62 41.27,3.49 42.23,2.54 73.66,2.54 77.47,6.35 77.47,57.15 68.9,65.72 R41.1
  Bottom 0.61: U1.13 48.81,34.42 46.04,31.75 45.4,31.11 45.4,30.48 | 45.4,30.48 R10.1 | v42.55,29.84 43.18,29.84 43.81,30.48 45.4,30.48
CELL3_VOLT
  Bottom 0.61: R20.2 43.07,55.14 R21.1 44.77,52.81 44.77,51.75 47.21,49.95 U1.26
CELL5
  Bottom 0.61: IC4.4 24.09,46.71 22.86,47.94 20.54,47.94 R54.2 18,50.7 17.78,45.4 9.84,45.4 Q19.D
CHARGE_LED
  Top 0.61: JP1.1 44.77,63.5 40.64,63.5 33.34,56.2 14.29,56.2 13.34,55.24 13.34,33.34 14.92,31.75 22.86,31.75 28.89,37.78 33.97,37.78 34.61,38.42 38.1,38.42 38.73,37.78 38.73,35.56 37.47,34.29 30.7,34.19 R50.2
CHARGE_SENSE  (via drill 1.1)
  Top 0.61: v42.23,43.5 42.23,49.85 v29.21,49.85
  Bottom 0.61: IC1.1 27.2,51.69 R43.2 v29.21,49.85 | U1.19 42.55,43.57 v42.23,43.5
CURRENT  (via drill 1.1)
  Top 0.61: v42.55,32.07 32.38,32.07 27.62,27.3 | v26.35,23.18 26.35,26.04 27.62,27.3 | R50.1 27.62,27.3
  Bottom 0.61: U1.14 47.94,40.65 47.94,35.24 44.77,32.07 v42.55,32.07 | v26.35,23.18 R7.1
EN_MEAS  (via drill 1.1)
  Top 0.61: v45.72,35.88 45.72,28.57 51.12,28.57 51.12,33.02 50.48,33.66 50.48,46.35 53.98,49.85 53.98,54.61 v54.13,54.77 54.13,56.67 48.9,61.91 v42.23,61.91
  Bottom 0.61: U1.32 52.01,49.47 52.32,49.47 53.66,50.8 53.66,54.29 v54.13,54.77 | R29.1 v42.23,61.91 40.01,61.91 38.73,63.18 R33.1 | R31.1 v45.72,35.88
GND  (via drill 1.1)
  Top 0.61: v39.69,58.1 v48.58,58.1 | v40.01,44.45 v40.01,33.66 | v53.02,33.02 55.24,35.24 | 55.24,35.24 54.93,35.56 v54.93,39.05 | 55.24,35.24 63.82,35.24 65.41,33.66 65.41,31.43 63.18,29.21 v62.87,29.21 68.26,23.81 R36.P$1 R37.P$1 | CELL3_LED.C CELL2_LED.C CELL1_LED.C PWR_LED.C 59.22,74.3 51.75,74.3 49.53,76.52 39.05,76.52 39.05,70.17 JP1.2 42.23,69.85 42.55,70.17 44.45,70.17 49.53,65.09 49.53,63.5 56.52,56.52 56.52,50.16 51.44,45.09 51.44,34.29 52.7,33.02 v53.02,33.02 | v53.02,33.02 53.02,32.7
  Bottom 0.61: Q9.2 53.44,28.96 | 53.44,28.96 R25.2 | R27.2 64.77,26.45 Q12.2 63.01,29.06 v62.87,29.21 | Q17.2 60.54,52.32 R45.2 60.33,53.66 60.33,55.24 59.69,55.88 | 69.53,58.74 IC2.3 69.53,71.12 65.41,75.25 54.29,75.25 | C5.2 69.9,58.37 69.53,58.74 | 69.53,58.74 69.17,58.37 C6.2 C3.2 61.28,58.37 | 61.28,58.37 C4.2 59.69,55.88 | IC3.3 61.28,58.37 | R32.2 35.17,32.8 Q15.2 34.93,33.34 34.92,32.07 28.26,32.07 28.26,30.16 | IC1.2 26.67,53.02 25.93,53.76 25.93,53.98 R51.1 24.87,53.98 24.13,53.98 23.18,53.02 23.18,49.21 24.13,48.26 25.08,48.26 IC4.2 25.08,43.18 24.66,42.76 R52.1 21.95,42.49 Q19.S 17.46,42.49 ICSP.6 15.56,35.88 15.56,30.8 16.19,30.16 28.26,30.16 | 56.83,38.73 C1.1 57.1,40.32 63.18,40.32 63.18,44.45 61.91,46.04 54.76,46.04 54.37,45.96 | 56.83,38.73 C2.1 | U1.5 54.52,44.36 54.93,44.77 54.93,45.4 54.37,45.96 | 54.37,45.96 U1.3 51.04,45.96 50.25,45.17 U1.21 40.01,45.17 v40.01,44.45 | 59.69,55.88 R47.2 58.52,56.2 | Q6.2 37.95,27.87 R26.2 37.78,32.49 R32.2 | v39.69,58.1 39.69,58.57 Q16.2 38,58.57 R34.2 | v48.58,58.1 46.99,58.1 Q14.2 46.89,58.03 R30.2 48.93,61.28 CON1.1 | 28.26,30.16 28.26,29.38 Q3.2 29.21,25.82 R28.2 | v40.01,33.66 40.01,32.7 R32.2 | 53.44,28.96 53.27,28.96 52.39,29.84 52.39,32.38 v53.02,33.02 | v54.93,39.05 56.52,39.05 56.83,38.73 | CON1.1 44.1,70.77 43.5,70.17 | 43.5,70.17 42.23,68.9 JP1.2 | 54.29,75.25 51.81,75.25 49.21,72.71 48.93,72.42 CON1.1 | BATTERY_OUT.P$1 BATTERY_OUT.P$2 54.29,75.25 | 43.5,70.17 CHARGER_IN.P$1 CHARGER_IN.P$2 32.38,72.71 27.94,77.15 22.86,77.15 21.91,78.11 BATTERY_CHARGE.P$1
LOAD  (via drill 1.1)
  Top 0.61: v11.43,39.37 v11.43,56.83
  Bottom 0.61: IC4.3 24.13,44.23 21.49,45.19 19.68,45.4 R54.1 20.64,45.4 21.59,44.77 20,44.77 19.05,43.81 13.34,43.81 12.38,42.86 12.38,39.37 v11.43,39.37 | MOTOR_2.P$2 MOTOR_2.P$1 MOTOR_1.P$1 MOTOR_1.P$2 v11.43,56.83
LOAD_SENSE  (via drill 1.1)
  Top 0.61: v36.83,45.09 27.94,45.09 v27.94,44.13
  Bottom 0.61: R53.2 26.04,43.78 IC4.1 26.03,44.13 v27.94,44.13 | U1.22 36.83,45.96 v36.83,45.09
MISO
  Bottom 0.61: U1.16 44.78,40.65 44.13,40.01 40.64,40.01 39.69,40.96 38.42,40.96 37.78,41.59 35.24,41.59 34.61,42.23 31.43,42.23 29.84,40.64 29.84,38.42 24.77,33.34 ICSP.1
MOSI
  Bottom 0.61: U1.15 47.21,39.27 46.67,38.73 40.64,38.73 39.37,40.01 38.1,40.01 37.47,40.64 34.92,40.64 34.29,41.27 31.75,41.27 30.8,40.32 30.8,38.1 23.81,31.11 19.68,31.11 18.73,32.07 18.73,33.97 20,35.24 ICSP.4
N$1
  Bottom 0.61: R6.2 34.61,25.86 Q1.1
N$2
  Bottom 0.61: R5.1 31.04,20.22 Q2.1 32.13,20.23 Q1.3
N$3  (via drill 1.1)
  Top 0.61: v26.99,13.65 20.95,19.68 R1.P$1
  Bottom 0.61: Q1.2 36.51,25.23 36.51,21.13 Q2.3 35.62,18.36 38.73,15.24 38.73,12.38 35.56,9.21 31.43,9.21 v26.99,13.65
N$4
  Bottom 0.61: R11.2 57.79,28.79 Q7.1
N$5
  Bottom 0.61: R4.1 51.13,20.23 Q8.1 58.3,23.98 Q7.3
N$6
  Bottom 0.61: Q3.3 33.72,30.63 R6.1
N$7
  Bottom 0.61: R7.2 R28.1 31.01,28.33 Q3.1
N$8
  Bottom 0.61: Q4.1 45.72,25.82 R9.2
N$9
  Bottom 0.61: Q4.3 42.92,20.23 Q5.1 41.87,20.85 R8.1
N$10
  Bottom 0.61: X1.1 57.08,35.9 C2.2 55.29,36.15 53.33,38.11 U1.8
N$11  (via drill 1.1)
  Top 0.61: v38.73,5.71 33.52,5.71 R2.P$2 24.9,5.54 22.86,5.4 9.98,5.4 R35.P$2
  Bottom 0.61: R8.2 39.71,19.15 Q5.4 44.77,11.75 v38.73,5.71
N$12
  Bottom 0.61: Q6.3 42.06,26.82 42.23,25.08 42.23,24.03 R9.1
N$13
  Bottom 0.406: Q6.1 39.69,26.04 40.32,27.3 40.32,28.26 | 40.32,28.26 40.32,28.57 40.56,28.55 40.32,28.26 | 40.32,28.26 44.98,28.26 R10.2
  Bottom 0.61: R26.1 39.59,29.52 40.56,28.55
N$14
  Bottom 0.61: R24.2 R11.1
N$15  (via drill 1.1)
  Top 0.61: R13.P$2 44.95,5.71 v50.48,5.71 50.48,13.97 70.48,13.97 75.88,19.37 75.88,33.66 69.85,39.69 R3.P$2
  Bottom 0.61: R4.2 55.54,14.1 | 55.54,14.1 Q8.4 | 55.54,14.1 55.54,10.77 v50.48,5.71
N$16
  Bottom 0.61: Q9.3 54.46,31.43 R24.1
N$17
  Bottom 0.61: R12.2 R25.1 55.24,26.45 Q9.1
N$18
  Bottom 0.61: R15.2 69.53,26.5 Q10.1
N$19
  Bottom 0.61: Q10.3 69.73,23.98 Q11.1 65.97,20.22 R14.1
N$20
  Bottom 0.61: R23.2 37.78,53.66 37.78,55.73 Q16.3
N$21  (via drill 1.1)
  Top 0.61: R37.P$2 57.01,5.71 v62.55,5.71 68.08,5.71 R36.P$2
  Bottom 0.61: R14.2 66.97,14.1 Q11.4 68.26,11.43 v62.55,5.71
N$22
  Bottom 0.61: Q12.3 69.28,31.26 R15.1
N$23
  Bottom 0.61: R16.2 R27.1 66.57,28.96 Q12.1
N$24
  Bottom 0.61: R22.2 30.16,33.66 32.24,33.66 Q15.3
N$25
  Bottom 0.61: 46.04,55.56 Q14.3 46.57,55.2 R21.2
N$26
  Top 0.61: R38.2 PWR_LED.A
N$27
  Bottom 0.61: 44.77,60.86 R30.1 45.19,58.03 Q14.1 43.45,57.93 R29.2
N$28
  Top 0.61: R39.2 CELL1_LED.A
N$29
  Bottom 0.61: Q15.1 37.68,34.92 R32.1 39.69,35.66 39.9,35.88 R31.2
N$30
  Top 0.61: CELL2_LED.A R40.2
N$31
  Top 0.61: CELL3_LED.A R41.2
N$32
  Bottom 0.61: Q16.1 36.2,61.18 R34.1 36.08,61.49 36.08,62.97 R33.2
N$33
  Bottom 0.61: Q2.4 32.89,13.65 32.07,13.65 27.62,18.1 R5.2 26.25,18.52 4.45,38.42 4.45,48.9 10.79,54.61 20,54.61 20,55.56 23.46,55.56 | IC1.3 27.3,53.97 27.3,55.56 23.46,55.56 | 23.46,55.56 23.46,57.01 R42.1
N$34
  pour Bottom: 0.32,84.77 80.33,84.77 80.33,0 0,0 0,84.45
N$35
  pour Top: 0,84.77 80.33,84.77 80.33,0 0,0
N$36
  Top 0.61: R1.P$2 15.56,9.03 D1.C
N$37
  Bottom 0.61: R45.1 58.84,52.12 | 58.84,52.12 Q17.1 | R44.2 57.42,50.7 58.84,52.12
N$39
  Bottom 0.406: Q18.3 68.26,39.05
  Bottom 0.61: R49.1 68.26,36.09 | 68.26,36.09 67.36,36.09 Q13.1 | 68.26,39.05 68.26,36.09
N$40
  Bottom 0.61: R51.2 25.08,49.95 R43.1
N$41
  Bottom 0.61: R48.2 65.09,41.74 Q18.1
N$42
  Bottom 0.61: Q17.3 61.01,48.75 R48.1
N$44
  Bottom 0.61: R52.2 R53.1
PB6
  Bottom 0.61: X1.2 59.98,42.86 56.83,42.86 C1.2 56.66,42.76 U1.7
RESET  (via drill 1.1)
  Top 0.61: v51.44,51.75 51.44,54.93 14.92,54.93 14.92,39.37 v18.73,39.37
  Bottom 0.61: R17.2 31.01,44.13 30.48,44.13 27.94,41.59 27.94,39.37 v18.73,39.37 18.73,35.24 17.46,33.97 ICSP.5 | U1.29 49.62,49.94 v51.44,51.75
SCK
  Bottom 0.61: U1.17 44.83,41.97 43.81,40.96 40.96,40.96 40.01,41.91 38.73,41.91 38.1,42.55 35.56,42.55 34.92,43.18 31.11,43.18 28.89,40.96 28.89,38.73 24.77,34.61 21.27,34.61 ICSP.3
SCL
  Bottom 0.61: CON1.3 51.93,55.42 48.81,52.3 U1.28
SDA
  Bottom 0.61: U1.27 48.02,52.78 50.43,55.19 CON1.2
SWITCH_PWR  (via drill 1.1)
  Top 0.61: v65.41,60.33 65.41,57.47 75.25,47.62 v75.25,37.15
  Bottom 0.61: IC3.1 63.18,62.45 C3.1 65.36,60.37 v65.41,60.33 | Q13.2 68.8,33.66 R49.2 69.64,34.29 73.03,34.29 75.25,36.51 v75.25,37.15 74.61,37.78 74.61,73.66 67.94,80.33 53.02,80.33 53.02,76.52 51.12,76.52 49.21,74.61 47.31,74.61 47.31,72.07 34.61,72.07 30.11,76.57 CON2.2
SWITCH_SENSE  (via drill 1.1)
  Top 0.61: v56.2,60.01 v42.55,73.66
  Bottom 0.61: U1.1 53.91,47.56 55.24,48.9 55.24,52.7 56.52,53.98 R47.1 56.62,59.27 v56.2,60.01 | v42.55,73.66 37.84,78.42 CON2.4
SYS_POWER  (via drill 1.1)
  Top 0.61: v49.53,32.07 49.21,32.38 49.21,53.02 v16.83,53.02
  Bottom 0.61: v16.83,53.02 15.56,53.02 15.56,47.05 Q19.G | U1.12 49.62,32.16 v49.53,32.07